# Altium schematic sheet SwitchMatrixSchem.SchDoc
size A4
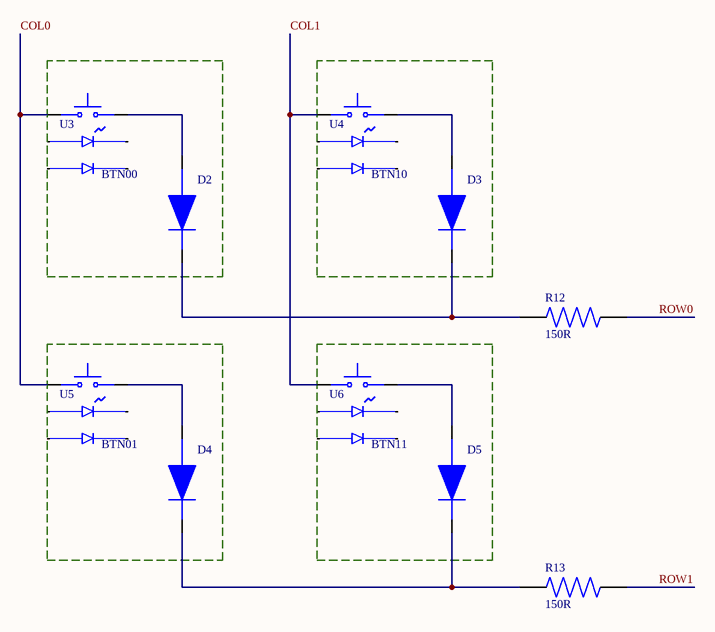
[diagram p0: SwitchMatrixSchem.SchDoc]

## Parts
D2  RectifierDiode  [DO-219AB_VIS-M]  (value not drawn)
D3  RectifierDiode  [DO-219AB_VIS-M]  (value not drawn)
D4  RectifierDiode  [DO-219AB_VIS-M]  (value not drawn)
D5  RectifierDiode  [DO-219AB_VIS-M]  (value not drawn)
R12  150R  [RES0608_150OHM]
R13  150R  [RES0608_150OHM]
U3  Switch  [CHERRYMX_5PIN]  (value not drawn)
U4  Switch  [CHERRYMX_5PIN]  (value not drawn)
U5  Switch  [CHERRYMX_5PIN]  (value not drawn)
U6  Switch  [CHERRYMX_5PIN]  (value not drawn)

## Blocks framed on the sheet
BTN00: D2 U3
BTN10: D3 U4
BTN01: D4 U5
BTN11: D5 U6

## Nets
COL0: U3.1 U5.1
COL1: U4.1 U6.1
ROW0: R12.2
ROW1: R13.2
NetD2_1: D2.1 U3.2
NetD2_2: D2.2 D3.2 R12.1
NetD3_1: D3.1 U4.2
NetD4_1: D4.1 U5.2
NetD4_2: D4.2 D5.2 R13.1
NetD5_1: D5.1 U6.2

Not connected (* = marked no-connect by the designer): U3 3 4 5 6; U4 3 4 5 6; U5 3 4 5 6; U6 3 4 5 6

## Library data of the parts
D2-D5 = ES07D-GS08: VISHAY - ES07D-GS08 - Fast / Ultrafast Diode, 200 V, 1.2 A, Single, 980 mV, 25 ns, 30 A; Supplier 1: Digi-Key; Supplier Part Number 1: ES07D-GS08CT-ND; Manufacturer: Vishay; Manufacturer Part Number: ES07D-GS08; RoHS: Yes; Category: Rectifier Diodes; Stock 1: 4306; Pricing 1: 1=0.45000, 10=0.36200, 100=0.24640, 500=0.18480, 1000=0.13860 (USD); RoHS Compliant: Yes; ComponentLink1URL: http://www.farnell.com/datasheets/2046053.pdf?src-supplier=Farnell; ComponentLink1Description: http://www.farnell.com/datasheets/2046053.pdf?src-supplier=Farnell
R12 R13 = CRCW0603150RFKEAHP: Res Thick Film 0603 150 Ohm 1% 0.33W(1/3W) ±100ppm/°C Pad SMD Automotive T/R; Manufacturer: Vishay; Power Rating: 250mW; Voltage Rating: 75V; Supplier 1: Digi-Key; Supplier Part Number 1: 541-150SCT-ND; Manufacturer Part Number: CRCW0603150RFKEAHP; RoHS: Yes; Category: Chip SMD Resistors; Stock 1: 10924; Pricing 1: 1=0.17000, 10=0.14800, 100=0.05790, 1000=0.02422, 2500=0.02220 (USD); Mount: Surface Mount; Case/Package: 0603; Case Code (Metric): 1608; Case Code (Imperial): 0603; Contact Plating: Tin; Weight: 7.1E-05oz; Min Operating Temperature: -55°C; Max Operating Temperature: 155°C; Package Quantity: 1; Resistance: 150R; Tolerance: 1%; Packaging: Tape and Reel; Resistor Type: Thick Film; Number of Terminations: 2; Max Power Dissipation: 250mW; Temperature Coefficient: 100ppm/°C; Features: Automotive AEC-Q200; Series: CRCW-HP; Termination: SMD/SMT; Voltage Rating (DC): 75V; Technology: THICK FILM; Resistance Tolerance: 1%; Construction: Rectangular; Length: 1.55mm; Width: 0.033inch; Height: 0.45mm; Depth: 0.85mm; Radiation Hardening: No; Lead Free: Lead Free; RoHS Compliant: Yes; REACH SVHC: Unknown; Military Standard: Not; ComponentLink1URL: https://datasheet.ciiva.com/6551/crcwhpe3-6551676.pdf?src-supplier=Digi-Key; ComponentLink1Description: https://datasheet.ciiva.com/6551/crcwhpe3-6551676.pdf?src-supplier=Digi-Key; ComponentLink2URL: https://datasheet.ciiva.com/12559/crcwhpe3-46056-12559198.pdf?src-supplier=Mouser; ComponentLink2Description: https://datasheet.ciiva.com/12559/crcwhpe3-46056-12559198.pdf?src-supplier=Mouser
U3-U6 = CherryMXKeyswitch: ZF CHERRY   MX1A-E1NN   SWITCH, TACTILE, SPST-NO, 10mA, THOUGH HOLE; Number of Terminals/Pins: 2; Mechanical Life: 20000000Cycles; Voltage Rating (AC): 12V; Throw Configuration: SPST; Contact Resistance: 200mR; Operating Force: 0.5N; Illumination Type: Illuminated; Switch Function: Off-Mom; Row Spacing: 2.54mm; Actuator Length: 3.6mm; Supplier 1: Digi-Key; Supplier Part Number 1: CH196-ND; Manufacturer: Cherry; Manufacturer Part Number: MX1A-E1NN; RoHS: Yes; Category: Pushbutton Switches; Stock 1: 7601; Pricing 1: 1=1.07000, 10=0.95700, 25=0.90880, 50=0.86460, 100=0.82420, 250=0.78780, 500=0.70700, 1000=0.66660 (USD); Mount: Panel,Front,Through Hole; Number of Pins: 2; Contact Material: Gold,Silver; Contact Plating: Gold; Housing Material: Thermoplastic; Min Operating Temperature: -10°C; Max Operating Temperature: 70°C; Voltage Rating (DC): 12V; Max Current Rating: 10mA; Current Rating: 10mA; Packaging: Bulk; Max Voltage Rating (AC): 12V; Max Voltage Rating (DC): 12V; Termination: PC Pin; Electrical Life: 20000000Cycles; Orientation: Straight; Contact Current Rating: 10mA; Series: MX; Length: 15.6mm; Width: 15.6mm; Terminal Pitch: 6.35mm; REACH SVHC: No SVHC; Lead Free: Lead Free; RoHS Compliant: Yes; ComponentLink1URL: https://datasheet.ciiva.com/2870/mxseries-2870411.pdf?src-supplier=Digi-Key; ComponentLink1Description: https://datasheet.ciiva.com/2870/mxseries-2870411.pdf?src-supplier=Digi-Key